# Altium schematic sheet DigitalBlad.SchDoc
size A4; SheetNumber: 2; SheetTotal: 2; SPICEModelCachePQRIQCIQ: <root> / <DocumentId>PQRIQCIQ</DocumentId> / </root>
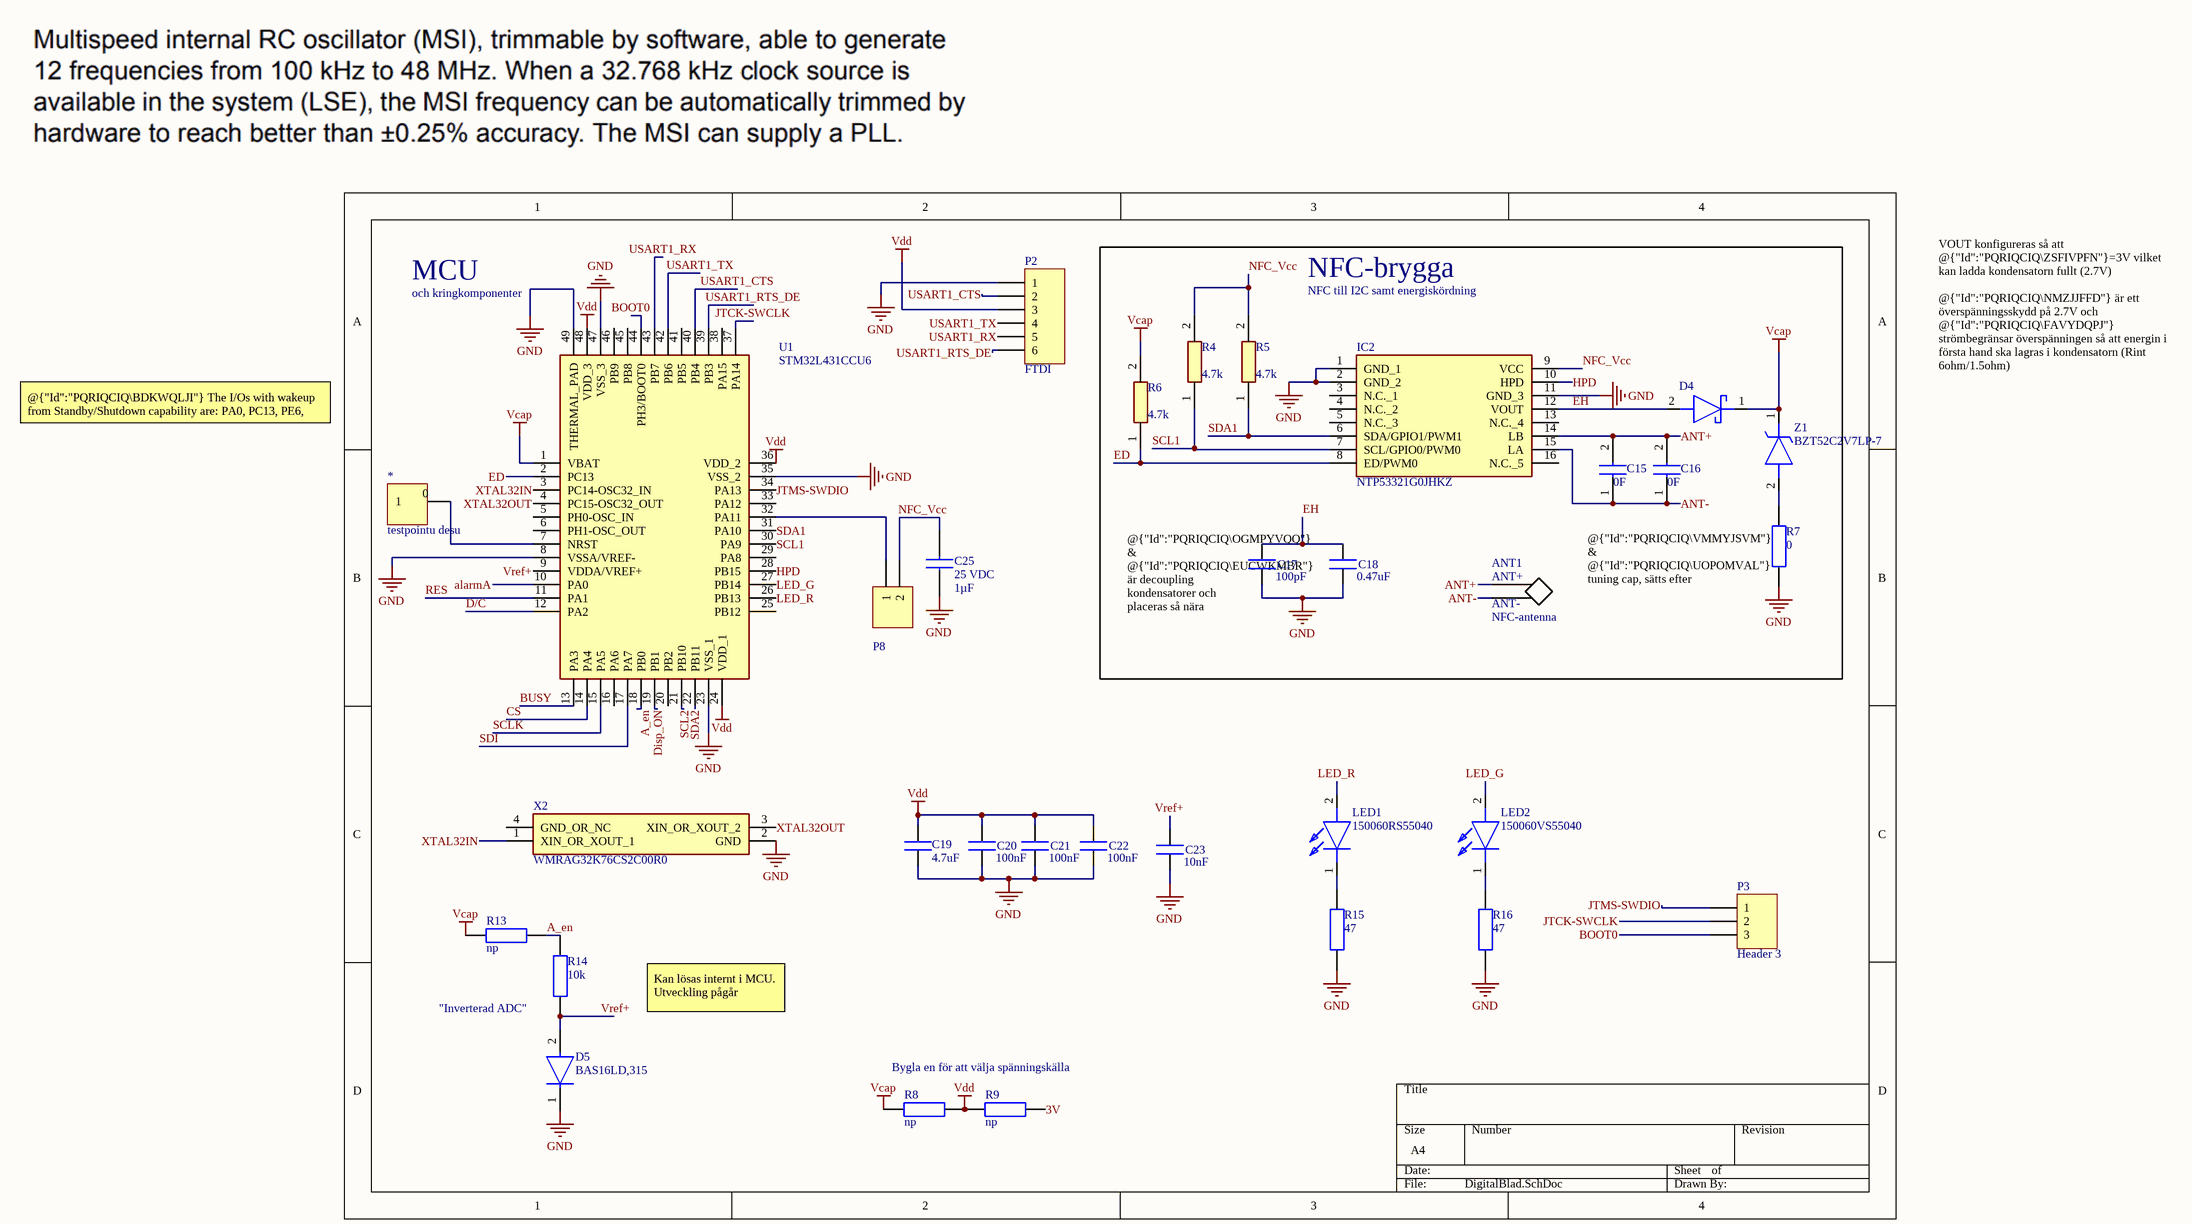
[diagram p0: DigitalBlad.SchDoc]

## Parts
*  testpointu desu  [Testupoint]
ANT1  NFC-antenna  [Antenna1]
C15  value 0F  [CAPC1005X70N]  (hidden comment: GRM155C81C474KE01D)
C16  value 0F  [CAPC1005X70N]  (hidden comment: GRM155C81C474KE01D)
C17  capacitance: 100pF  [CAPC1005X70N]  (hidden comment: C0402C101KCGACAUTO)
C18  capacitance: 0.47uF  [CAPC1005X70N]  (hidden comment: C0402C101KCMBASJ105SB7474KFNA01GACAUTO)
C19  capacitance: 4.7uF  [CAPC1005X70N]  (hidden comment: C0402C475K8PACTU)
C20  capacitance: 100nF  [CAPC1005X70N]  (hidden comment: MLAST105SB5104KFNA01)
C21  capacitance: 100nF  [CAPC1005X70N]  (hidden comment: MLAST105SB5104KFNA01)
C22  capacitance: 100nF  [CAPC1005X70N]  (hidden comment: MLAST105SB5104KFNA01)
C23  capacitance: 10nF  [CAPC1005X70N]  (hidden comment: VJ0402Y103KXJAC31X)
C25  value 1µF  Rated Voltage: 25 VDC  [CAPC1005X55N]  (hidden comment: GRM155R61E105KA12D)
D4  RBE01VYM6AFHTR  [RBE01VYM6AFHTR]  (value not drawn)
D5  BAS16LD,315  [FP-SOD882D-MFG]
IC2  NTP53321G0JHKZ  [NTP53321G0JHKZ]
LED1  150060RS55040  [150060RS55040]
LED2  150060VS55040  [LEDM168X50N]
P2  FTDI  [HDR1X6]
P3  Header 3  [HDR1X3]
P8  Header 2  [HDR1X2]  (value not drawn)
R4  Resistance: 4.7k  [RESC1005X40N]  (hidden comment: CRCW04024K70FKEDHP)
R5  Resistance: 4.7k  [RESC1005X40N]  (hidden comment: CRCW04024K70FKEDHP)
R6  Resistance: 4.7k  [RESC1005X40N]  (hidden comment: CRCW04024K70FKEDHP)
R7  resistance: 0  [RESC1005X40N]  (hidden comment: SFR01MZPJ470)
R8  resistance: np  [RESC1005X40N]  (hidden comment: Generic component)
R9  resistance: np  [RESC1005X40N]  (hidden comment: Generic component)
R13  resistance: np  [RESC1005X40N]  (hidden comment: Generic component)
R14  resistance: 10k  [RESC1005X40N]  (hidden comment: CRCW04024K70FKEDHP)
R15  resistance: 47  [RESC1005X40N]  (hidden comment: SFR01MZPJ470)
R16  resistance: 47  [RESC1005X40N]  (hidden comment: SFR01MZPJ470)
U1  STM32L431CCU6  [QFN50P700X700X60-49N-D]
X2  WMRAG32K76CS2C00R0  [WMRAG32K76CS2C00R0]
Z1  BZT52C2V7LP-7  [BZT52C2V7LP7]

## Blocks framed on the sheet
NFC-brygga: ANT1 C15-C18 D4 IC2 R4-R7 Z1

## Nets
GND: C17.1 C18.1 C19.2 C20.2 C21.2 C22.2 C23.2 C25.2 D5.1(C) IC2.1(GND_1) IC2.2(GND_2) IC2.11(GND_3) P2.1 R7.2 R15.1 R16.1 U1.8(VSSA/VREF-) U1.23(VSS_1) U1.35(VSS_2) U1.47(VSS_3) U1.49(THERMAL_PAD) X2.2(GND)
Vcap: D4.1(K) R6.2 R8.2 R13.2 U1.1(VBAT) Z1.1(K)
Vdd: C19.1 C20.1 C21.1 C22.1 P2.3 R8.1 R9.2 U1.24(VDD_1) U1.36(VDD_2) U1.48(VDD_3)
3V: R9.1
A_en: R13.1 R14.2 U1.18(PB0)
alarmA: U1.10(PA0)
ANT+: ANT1.1(+) C15.2 C16.2 IC2.14(LB)
ANT-: ANT1.1(-) C15.1 C16.1 IC2.15(LA)
BOOT0: P3.3 U1.44(PH3/BOOT0)
BUSY: U1.13(PA3)
CS: U1.14(PA4)
D/C: U1.12(PA2)
Disp_ON: U1.19(PB1)
ED: IC2.8(ED/PWM0) R6.1 U1.2(PC13)
EH: C17.2 C18.2 D4.2(A) IC2.12(VOUT)
HPD: IC2.10(HPD) U1.28(PB15)
JTCK-SWCLK: P3.2 U1.37(PA14)
JTMS-SWDIO: P3.1 U1.34(PA13)
LED_G: LED2.2(A) U1.27(PB14)
LED_R: LED1.2(A) U1.26(PB13)
NFC_Vcc: C25.1 IC2.9(VCC) P8.2 R4.2 R5.2
RES: U1.11(PA1)
SCL1: IC2.7(SCL/GPIO0/PWM0) R4.1 U1.30(PA9)
SCL2: U1.21(PB10)
SCLK: U1.15(PA5)
SDA1: IC2.6(SDA/GPIO1/PWM1) R5.1 U1.31(PA10)
SDA2: U1.22(PB11)
SDI: U1.17(PA7)
USART1_CTS: P2.2 U1.40(PB4)
USART1_RTS_DE: P2.6 U1.39(PB3)
USART1_RX: P2.5 U1.43(PB7)
USART1_TX: P2.4 U1.42(PB6)
Vref+: C23.1 D5.2(A) R14.1 U1.9(VDDA/VREF+)
XTAL32IN: U1.3(PC14-OSC32_IN) X2.1(XIN_OR_XOUT_1)
XTAL32OUT: U1.4(PC15-OSC32_OUT) X2.3(XIN_OR_XOUT_2)
Net*_0: *.0(1) U1.7(NRST)
NetLED1_1: LED1.1(K) R15.2
NetLED2_1: LED2.1(K) R16.2
NetP8_1: P8.1 U1.32(PA11)
NetR7_1: R7.1 Z1.2(A)

Not connected (* = marked no-connect by the designer): IC2 3(N.C._1) 4(N.C._2) 5(N.C._3) 13(N.C._4) 16(N.C._5); U1 5(PH0-OSC_IN) 6(PH1-OSC_OUT) 16(PA6) 20(PB2) 25(PB12) 29(PA8) 33(PA12) 38(PA15) 41(PB5) 45(PB8) 46(PB9); X2 4(GND_OR_NC)

## Notes on the sheet
- MCU
- och kringkomponenter
- NFC till I2C samt energiskördning
- @{"Id":"PQRIQCIQ\BDKWQLJI"} The I/Os with wakeup from Standby/Shutdown capability are: PA0, PC13, PE6, PA2, PC5.
- VOUT konfigureras så att @{"Id":"PQRIQCIQ\ZSFIVPFN"}=3V vilket kan ladda kondensatorn fullt (2.7V)
  @{"Id":"PQRIQCIQ\NMZJJFFD"} är ett överspänningsskydd på 2.7V och @{"Id":"PQRIQCIQ\FAVYDQPJ"} strömbegränsar överspänningen så att energin i första hand ska lagras i kondensatorn (Rint  6ohm/1.5ohm)
- (near C17) @{"Id":"PQRIQCIQ\OGMPYVQQ"} & @{"Id":"PQRIQCIQ\EUCWKMBR"}
  är decoupling kondensatorer och placeras så nära NTPn som möjligt
- @{"Id":"PQRIQCIQ\VMMYJSVM"} & @{"Id":"PQRIQCIQ\UOPOMVAL"}
  tuning cap, sätts efter uppmätt induktans på antennen
- (near R14) "Inverterad ADC"
- Kan lösas internt i MCU. Utveckling pågår
- Bygla en för att välja spänningskälla
- (in symbol NFC-antenna) ANT+; ANT-

## Library data of the parts
C15 C16 = CMP-001-00140-1: Multilayer Ceramic Capacitors MLCC - SMD/SMT; Manufacturer_Name: Murata Electronics; Design Item ID: GRM155C81C474KE01D; Mouser Part Number: 81-GRM155C81C474KE1D; Height: 0.7mm; Source: SamacSys.SchLib; Mouser Price/Stock: https://www.mouser.com/Search/Refine.aspx?Keyword=81-GRM155C81C474KE1D; Manufacturer_Part_Number: GRM155C81C474KE01D; Datasheet Link: https://search.murata.co.jp/Ceramy/image/img/A01X/G101/ENG/GRM155C81C474KE01-01A.pdf
C17 C18 = Generic capacitor: Multilayer Ceramic Capacitors MLCC - SMD/SMT 500V 0.0001uF C0G 0402 10% AEC-Q200; ComponentLink1Description: New link
  C17: ComponentLink1URL: https://www.mouser.se/ProductDetail/KEMET/C0402C101KCGACAUTO?qs=1Kr7Jg1SGW8kQysZZQPmCw%3D%3D
  C18: ComponentLink1URL: https://www.mouser.se/ProductDetail/TAIYO-YUDEN/MBASJ105SB7474KFNA01?qs=tlsG%2FOw5FFh70%252Bw5vm%252Bxgg%3D%3D
C19 = Generic capacitor: Multilayer Ceramic Capacitors MLCC - SMD/SMT; ComponentLink1Description: New link; ComponentLink1URL: https://www.mouser.se/ProductDetail/TAIYO-YUDEN/MLASJ105BB5475MFNA01?qs=sGAEpiMZZMsh%252B1woXyUXj3XUfju0vRpjpyIV14TsoXE%3D
C20-C22 = Generic capacitor: Multilayer Ceramic Capacitors MLCC - SMD/SMT 25V 0.1uF X5R 0402 10% Medical; ComponentLink1Description: New link; ComponentLink1URL: https://www.mouser.se/ProductDetail/TAIYO-YUDEN/MLAST105SB5104KFNA01?qs=sGAEpiMZZMsh%252B1woXyUXj3XUfju0vRpjIEu19pL458I%3D
C23 = Generic capacitor: Multilayer Ceramic Capacitors MLCC - SMD/SMT 0402 10nF 16volts X7R 10%; ComponentLink1Description: New link; ComponentLink1URL: https://www.mouser.se/ProductDetail/Vishay-Vitramon/VJ0402Y103KXJAC31X?qs=sGAEpiMZZMsh%252B1woXyUXj7JttxwcgSfbi%2FPlga%252BwiEM%3D
C25 = CMP-001-00126-1: Capacitor; Manufacturer_Name: Murata Electronics; Datasheet Link: https://search.murata.co.jp/Ceramy/image/img/A01X/G101/ENG/GRM155R61E105KA12-01A.pdf; Source: SamacSys.SchLib; Mouser Part Number: 81-GRM155R61E105KA2D; Arrow Part Number: GRM155R61E105KA12D; Manufacturer_Part_Number: GRM155R61E105KA12D; Design Item ID: GRM155R61E105KA12D; Arrow Price/Stock: https://www.arrow.com/en/products/grm155r61e105ka12d/murata-manufacturing?region=nac; Height: 0.55mm; Mouser Price/Stock: https://www.mouser.co.uk/ProductDetail/Murata-Electronics/GRM155R61E105KA12D?qs=hiffU4J9V6bE4a81t2Mv5A%3D%3D
D4 = CMP-004-00062-1: DIODE SCHOTTKY 6V 100MA TUMD2M; Manufacturer_Name: ROHM Semiconductor; Mouser Part Number: 755-RBE01VYM6AFHTR; Datasheet Link: https://www.digikey.ph/en/products/detail/rohm-semiconductor/RBE01VYM6AFHTR/24634517; Manufacturer_Part_Number: RBE01VYM6AFHTR; Source: SamacSys.SchLib; Design Item ID: RBE01VYM6AFHTR; Mouser Price/Stock: https://www.mouser.co.uk/ProductDetail/ROHM-Semiconductor/RBE01VYM6AFHTR?qs=VVKQmw408U8czvswzPLZtQ%3D%3D; Height: 0.8mm
D5 = CMP-14399-000004-1: DIODE GP 100V 215MA SOD882D; Manufacturer: Nexperia; Value: 1.5pF; Max Junction Temp: +150°C; Max Surge Forward Current: 0.5A; Peak Reverse Current: 0.5uA; Automotive Grade: Grade 0; Package: SOD882D; Category: Diode; Automotive: Yes; Footprint Url: https://assets.nexperia.com/documents/outline-drawing/SOD882D.pdf; RoHS: TRUE; ComponentLink2Description: Datasheet; Height: 0.4mm; Digikey Description: DIODE GP 100V 215MA SOD882D; Device Class L1: Discrete Semiconductors; Ambient Temperature Range High: +150°C; Capacitance: 1.5pF; Manufacturer Part Number: BAS16LD,315; Ambient Temperature Range Low: -55°C; Temperature: to +150°C; Max Repetitive Reverse Voltage: 100V; Temperature Range High: +150°C; Reverse Voltage: 100V; ComponentLink2URL: https://assets.nexperia.com/documents/data-sheet/BAS16LD.pdf; Octopart: https://octopart.com/bas16ld%2C315-nexperia-78753474; Device Class L3: Rectifier Diodes; Forward Current: 215mA; Device Class L2: Diodes; Mouser Description: BAS16LD - Single high-speed switching diode; Lead Free: Yes
IC2 = CMP-031-00011-1: Interface - Specialized NTAG; Manufacturer_Name: NXP; Source: SamacSys.SchLib; Mouser Price/Stock: https://www.mouser.co.uk/ProductDetail/NXP-Semiconductors/NTP53321G0JHKZ?qs=u16ybLDytRYy2Rt%2Fib73Dw%3D%3D; Height: 0.5mm; Design Item ID: NTP53321G0JHKZ; Datasheet Link: https://www.nxp.com/docs/en/data-sheet/NTP53x2.pdf; Arrow Price/Stock: https://www.arrow.com/en/products/ntp53321g0jhkz/nxp-semiconductors?region=nac; Mouser Part Number: 771-NTP53321G0JHKZ; Manufacturer_Part_Number: NTP53321G0JHKZ; Arrow Part Number: NTP53321G0JHKZ
LED1 = CMP-007-00073-1: RED Standard LEDs - SMD WL-SMCD SMD MonoChip 0603 Red 632nm; Manufacturer_Name: Wurth Elektronik; Mouser Part Number: 710-150060RS55040; Mouser Price/Stock: https://www.mouser.co.uk/ProductDetail/Wurth-Elektronik/150060RS55040?qs=8Aam6%252B7C6HHnMZFlrlTntA%3D%3D; Manufacturer_Part_Number: 150060RS55040; Datasheet Link: http://katalog.we-online.de/led/datasheet/150060RS55040.pdf; Design Item ID: 150060RS55040; Source: SamacSys.SchLib; Height: 0mm
LED2 = CMP-007-00074-1: Green LED; Manufacturer_Name: Wurth Elektronik; Mouser Part Number: 710-150060VS55040; Manufacturer_Part_Number: 150060VS55040; Datasheet Link: https://katalog.we-online.com/led/datasheet/150060VS55040.pdf; Design Item ID: 150060VS55040; Source: SamacSys.SchLib; Mouser Price/Stock: https://www.mouser.co.uk/ProductDetail/Wurth-Elektronik/150060VS55040?qs=8Aam6%252B7C6HEumg%252B0cJZzvA%3D%3D; Height: 0.5mm
P2 = CMP-002-00359-1: Header, 6-Pin; Signal Integrity: Connector; Source: Miscellaneous Connectors.SchLib; Pins: 6; Component Type: Standard; Design Item ID: Header 6; LatestRevisionDate: 17-Jul-2002; Publisher: Altium Limited; LatestRevisionNote: Re-released for DXP Platform.
P3 = CMP-002-00163-1: Header, 3-Pin; Signal Integrity: Connector; Source: Miscellaneous Connectors.SchLib; LatestRevisionNote: Re-released for DXP Platform.; Design Item ID: Header 3; Pins: 3; LatestRevisionDate: 17-Jul-2002; Component Type: Standard; Publisher: Altium Limited
P8 = CMP-002-00143-1: Header, 2-Pin; Signal Integrity: Connector; LatestRevisionNote: Re-released for DXP Platform.; Publisher: Altium Limited; Pins: 2; LatestRevisionDate: 17-Jul-2002; Design Item ID: Header 2; Component Type: Standard; Source: Miscellaneous Connectors.SchLib
R4-R6 = CMP-009-00230-1: CRCW Power Resistor 0402 0.063W 4K7 Vishay CRCW Series Thick Film Power Resistor 0402 Case 4.7k +/-1% 0.125W +/-100ppm/K; Source: SamacSys.SchLib; Height: 0.4mm; Manufacturer_Name: Vishay; Datasheet Link: http://www.vishay.com/docs/20035/dcrcwe3.pdf; Manufacturer_Part_Number: CRCW04024K70FKEDHP; Arrow Part Number: CRCW04024K70FKEDHP; Design Item ID: CRCW04024K70FKEDHP; Mouser Price/Stock: https://www.mouser.co.uk/ProductDetail/Vishay-Dale/CRCW04024K70FKEDHP?qs=k2%2FDWSARqgH3ASlI4vM3KQ%3D%3D; Mouser Part Number: 71-CRCW04024K70FKEDH; Arrow Price/Stock: https://www.arrow.com/en/products/crcw04024k70fkedhp/vishay?utm_currency=USD&region=nac
R7 R15 R16 = Generic resistor: Thick Film Resistors Sulfur Tolerant Chip Resistors 0402 case size; ComponentLink1Description: New link
  R7: ComponentLink1URL: *
  R15 R16: ComponentLink1URL: https://www.mouser.se/ProductDetail/ROHM-Semiconductor/SFR01MZPJ470?qs=sGAEpiMZZMvdGkrng054t2cqbZCzJY7NKh3gUwXOa5kuN5TNJ%252Bi2TA%3D%3D
R8 R9 R13 = Generic resistor: ComponentLink1Description: New link; ComponentLink1URL: *
R14 = Generic resistor: CRCW Power Resistor 0402 0.063W 4K7 Vishay CRCW Series Thick Film Power Resistor 0402 Case 4.7k +/-1% 0.125W +/-100ppm/K; ComponentLink1Description: New link; ComponentLink1URL: https://www.mouser.se/ProductDetail/Vishay-Dale/CRCW040210K0FKEDC?qs=sGAEpiMZZMvdGkrng054t0DrEhLhGh8ghRTPC4LoFoV0V5heIyAs3Q%3D%3D
U1 = CMP-031-00018-1: ARM Microcontrollers - MCU 16/32-BITS MICROS; Manufacturer_Name: STMicroelectronics; Mouser Part Number: 511-STM32L431CCU6; Height: 0.6mm; Arrow Part Number: STM32L431CCU6; Source: SamacSys.SchLib; Datasheet Link: http://www.st.com/content/ccc/resource/technical/document/datasheet/group3/83/b3/60/f6/b1/cc/47/7e/DM00257211/files/DM00257211.pdf/jcr:content/translations/en.DM00257211.pdf; Arrow Price/Stock: https://www.arrow.com/en/products/stm32l431ccu6/stmicroelectronics?region=nac; Mouser Price/Stock: https://www.mouser.co.uk/ProductDetail/STMicroelectronics/STM32L431CCU6?qs=U58vgkJzipRWiXTJcDrRbg%3D%3D; Manufacturer_Part_Number: STM32L431CCU6; Design Item ID: STM32L431CCU6
X2 = CMP-003-00031-1: 32.768 kHz +/-20ppm Crystal 8pF 75 kOhms 4-SMD; Manufacturer_Name: Murata Electronics; Manufacturer_Part_Number: WMRAG32K76CS2C00R0; Mouser Part Number: 81-WMRAG32K76CS2C00R; Source: SamacSys.SchLib; Height: 0.35mm; Datasheet Link: https://www.murata.com/products/productdata/8804604674078/SPEC-WMRAG32K76CS2C00R0.pdf; Design Item ID: WMRAG32K76CS2C00R0; Mouser Price/Stock: https://www.mouser.co.uk/ProductDetail/Murata-Electronics/WMRAG32K76CS2C00R0?qs=bZr6mbWTK5kWV2uyypDEfg%3D%3D
Z1 = CMP-004-00065-1: Zener Diode 2.7 V 250 mW +/-7% Surface Mount DFN1006-2; Manufacturer_Name: Diodes Incorporated; Source: SamacSys.SchLib; Height: 0.53mm; Arrow Price/Stock: https://www.arrow.com/en/products/bzt52c2v7lp-7/diodes-incorporated?utm_currency=USD&region=nac; Arrow Part Number: BZT52C2V7LP-7; Mouser Part Number: 621-BZT52C2V7LP-7; Manufacturer_Part_Number: BZT52C2V7LP-7; Design Item ID: BZT52C2V7LP-7; Datasheet Link: https://www.diodes.com/assets/Datasheets/BZT52C2V4LP-BZT52C39LP.pdf; Mouser Price/Stock: https://www.mouser.co.uk/ProductDetail/Diodes-Incorporated/BZT52C2V7LP-7?qs=DwnLFiA34IIEhdzEy1XKTQ%3D%3D